# Altium schematic sheet Cover.SchDoc
size A4; SheetNumber: 1; SheetTotal: 5
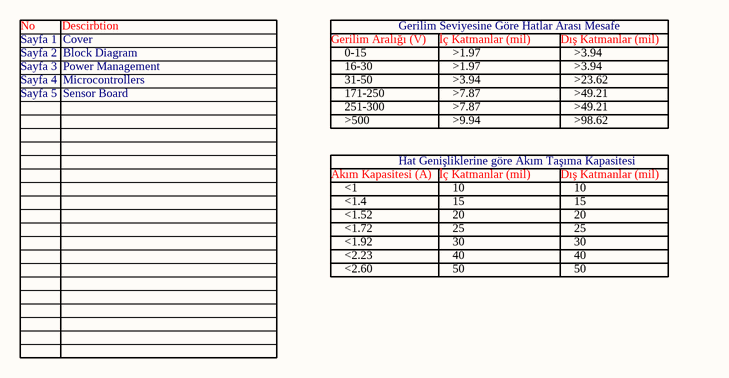
[diagram p0: Cover.SchDoc]

## Notes on the sheet
- Sayfa 1  Cover
- No         Descirbtion
- Gerilim Aralığı (V)
- Gerilim Seviyesine Göre Hatlar Arası Mesafe
- İç Katmanlar (mil)
- Dış Katmanlar (mil)
- Sayfa 2  Block Diagram
- Sayfa 3  Power Management
- Sayfa 4  Microcontrollers
- Sayfa 5  Sensor Board
- 0-15
- 16-30
- 31-50
- 171-250
- 251-300
- >7.87
- >3.94
- >1.97
- >23.62
- >49.21
- Akım Kapasitesi (A)
- >500
- Hat Genişliklerine göre Akım Taşıma Kapasitesi
- >9.94
- >98.62
- <1
- <1.4
- <1.52
- <1.72
- <1.92
- 10
- 15
- 20
- 25
- 30
- <2.23
- <2.60
- 40
- 50